# EAGLE schematic Calibrador (EAGLE 6.2)
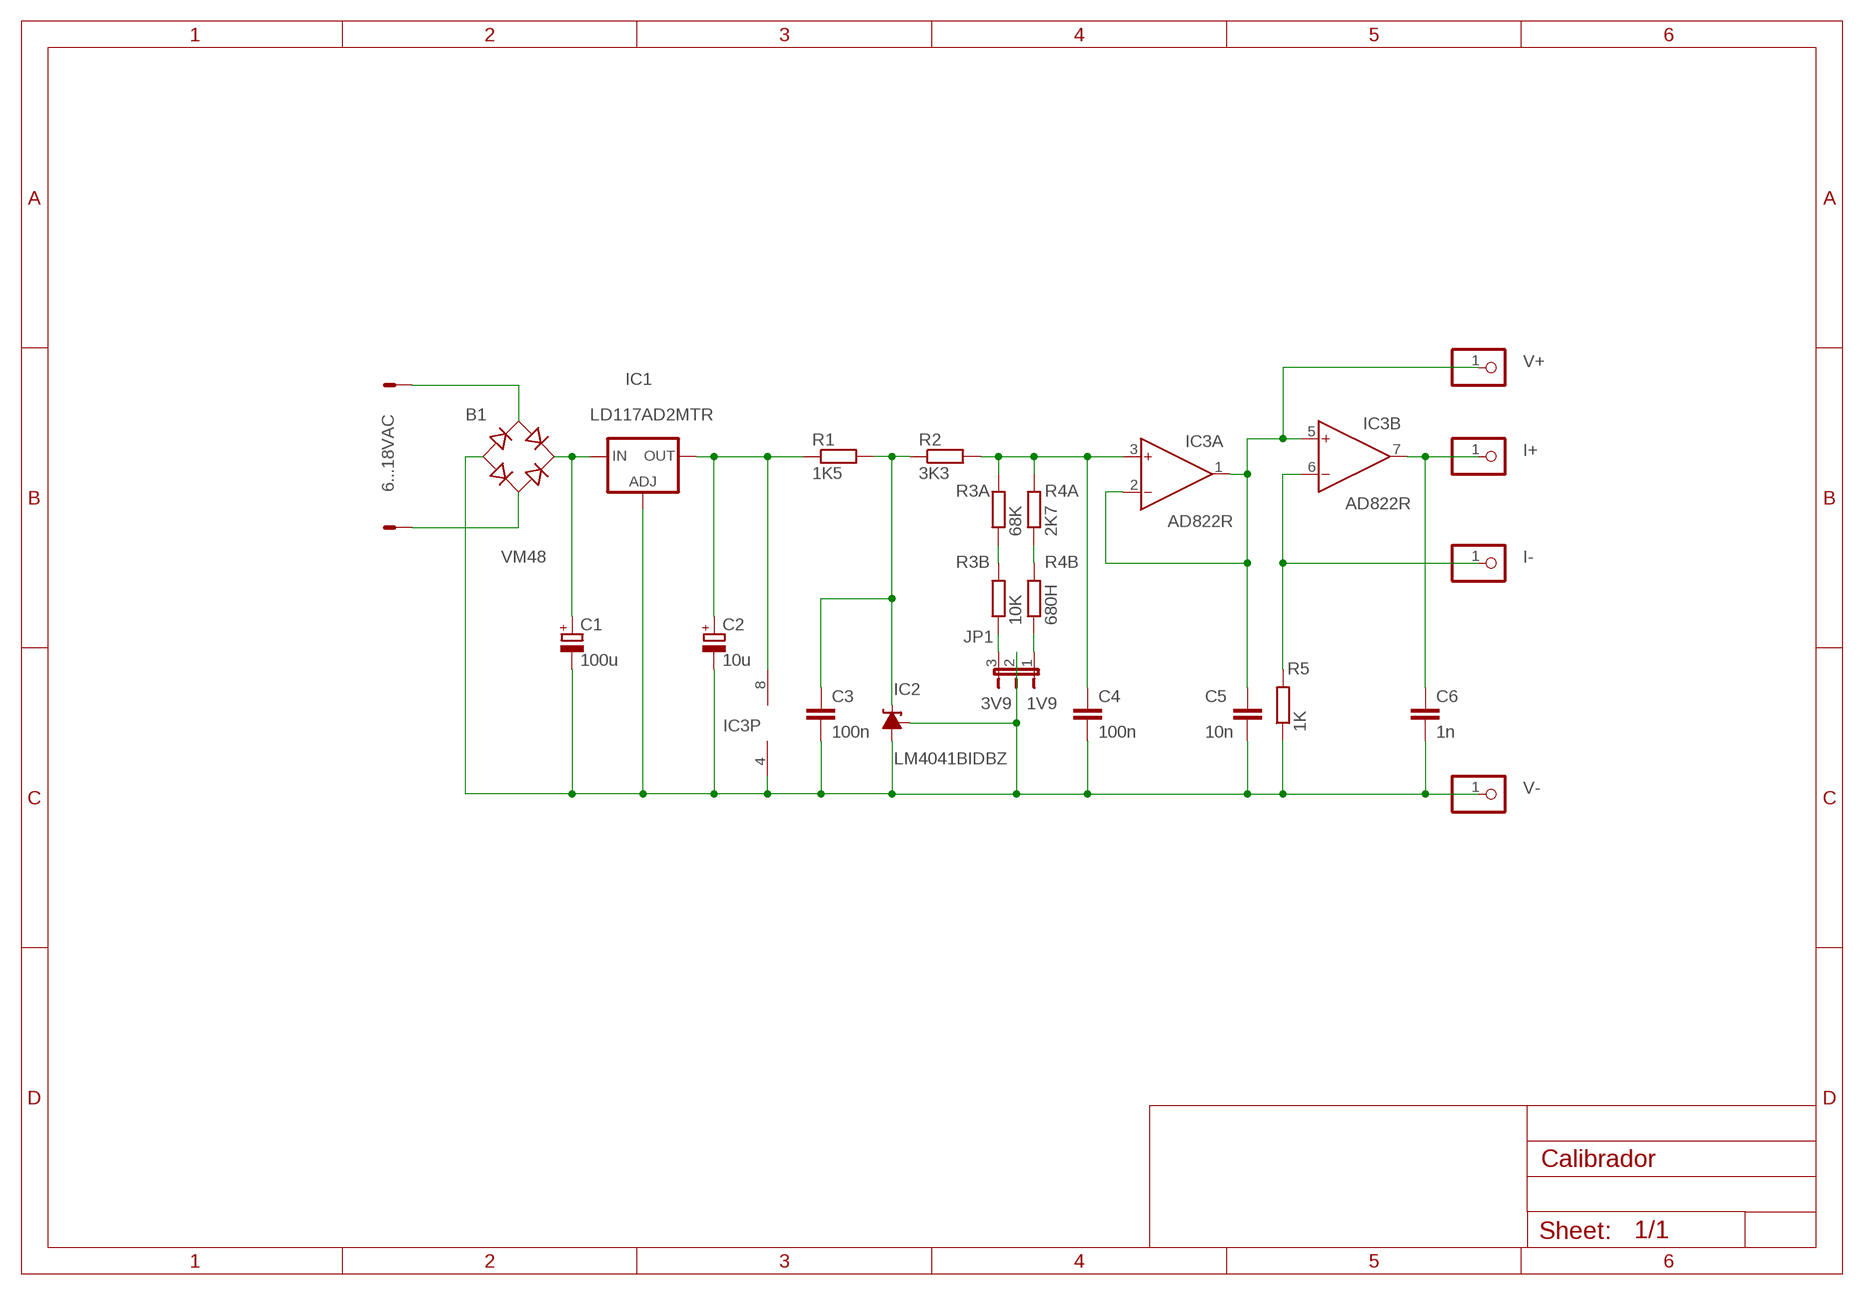
[diagram p0: schematic, sheet 1]

## Parts
B1  VM48  B-DIL  [B-DIL]
C1  100u  CPOL-EU153CLV-0807  [153CLV-0807]
C2  10u  CPOL-EU153CLV-0505  [153CLV-0505]
C3  100n  C-EUC0805  [C0805]
C4  100n  C-EUC0805  [C0805]
C5  10n  C-EUC0805  [C0805]
C6  1n  C-EUC0805  [C0805]
IC1  LD117AD2MTR  [D2PACK]
IC2  LM4041BIDBZ  [DBZ_R-PDSO-G3]
IC3  AD822R  [SO8]
J1  22-27-2021-02  [6410-02]
JP1  3V9 1V9  JP2E  [JP2]
JP2  V+  PINHD-1X1  [1X01]
JP3  I+  PINHD-1X1  [1X01]
JP4  I-  PINHD-1X1  [1X01]
JP5  V-  PINHD-1X1  [1X01]
R1  1K5  R-EU_0207/10  [0207/10]
R2  3K3  R-EU_0207/10  [0207/10]
R3A  68K  R-EU_0207/10  [0207/10]
R3B  10K  R-EU_0207/10  [0207/10]
R4A  2K7  R-EU_0207/10  [0207/10]
R4B  680H  R-EU_0207/10  [0207/10]
R5  1K  R-EU_0207/10  [0207/10]

## Nets
N$1: B1.AC1 J1.2
N$2: B1.AC2 J1.1
N$3: C3.1 IC2.2(C) R1.2 R2.1
N$4: B1.+ C1.+ IC1.3(IN)
N$5: C2.+ IC1.2(OUT) IC3.8(P:V+) R1.1
N$6: B1.- C1.- C2.- C3.2 C4.2 C5.2 C6.2 IC1.1(ADJ) IC2.1(FB) IC2.3(A) IC3.4(P:V-) JP1.2 JP5.1 R5.1
N$7: JP1.3 R3B.1
N$8: JP1.1 R4B.1
N$9: R4A.1 R4B.2
N$10: R3A.1 R3B.2
N$11: C4.1 IC3.3(A:IN+) R2.2 R3A.2 R4A.2
N$13: C5.1 IC3.1(A:OUT) IC3.2(A:IN-) IC3.5(B:IN+) JP2.1
N$15: C6.1 IC3.7(B:OUT) JP3.1
N$16: IC3.6(B:IN-) JP4.1 R5.2

## Notes on the sheet
- 6...18VAC

## Library data of the parts
B1 = rectifier:B-DIL: RECTIFIER
C1 C2 = rcl:CPOL-EU: POLARIZED CAPACITOR, European symbol
C3-C6 = resistor:C-EU: CAPACITOR, European symbol
IC1 = v-reg:LD117A?*: Low drop fixed and adjustable positive voltage regulators 1 A Source: http://www.st.com/stonline/products/literature/ds/7194/ld1117axx.pdf
IC2 = texas:LM4041*I: PRECISION MICROPOWER SHUNT VOLTAGE REFERENCE Adjustable Output Source: http://focus.ti.com/lit/ds/slcs146e/slcs146e.pdf; OC_FARNELL: unknown; OC_NEWARK: unknown
IC3 = analog-devices:AD822: Single-Supply, Rail-to-Rail Low Power FET-Input Op Amp Source: http://www.analog.com/static/imported-files/data_sheets/AD822.pdf; MF: ANALOG DEVICES; MPN: AD822BRZ; OC_FARNELL: 1651303
J1 = con-molex:22-?-02: CONNECTOR wire to board 2.54 mm (.1 inch) pitch header; OC_FARNELL: unknown; OC_NEWARK: unknown
JP1 = jumper:JP2E: JUMPER
JP2-JP5 = pinhead:PINHD-1X1: PIN HEADER
R1 R2 R3A R3B R4A R4B R5 = resistor:R-EU_: RESISTOR, European symbol